# Altium schematic sheet DC-DC SY8029AIC.SchDoc
size A4
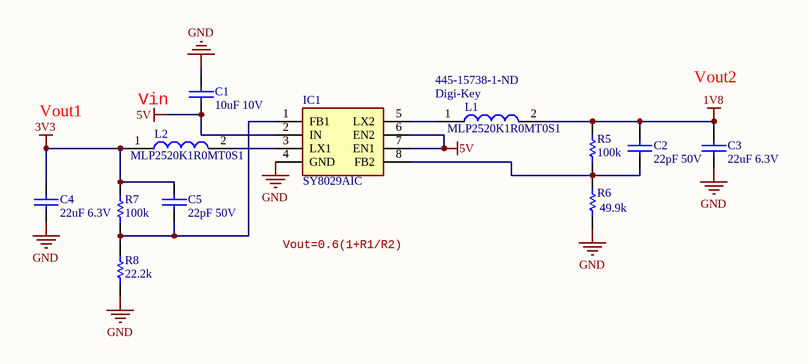
[diagram p0: DC-DC SY8029AIC.SchDoc]

## Parts
C1  10uF 10V  [0805C]
C2  22pF 50V  [0402C]
C3  22uF 6.3V  [0603C]
C4  22uF 6.3V  [0603C]
C5  22pF 50V  [0402C]
IC1  SY8029AIC  [SOT65P280X110-8N]
L1  MLP2520K1R0MT0S1  Supplier 1: Digi-Key  Supplier Part Number 1: 445-15738-1-ND  [INDC2520X100N]
L2  MLP2520K1R0MT0S1  [INDC2520X100N]
R5  100k  [0402R]
R6  49.9k  [0402R]
R7  100k  [0402R]
R8  22.2k  [0402R]

## Nets
1V8: C2.2 C3.2 L1.2 R5.2
3V3: C4.2 C5.2 L2.1 R7.2
5V: C1.1 IC1.2(IN) IC1.6(EN2) IC1.7(EN1)
GND: C1.2 C3.1 C4.1 IC1.4(GND) R6.1 R8.1
NetC2_1: C2.1 IC1.8(FB2) R5.1 R6.2
NetC5_1: C5.1 IC1.1(FB1) R7.1 R8.2
NetIC1_3: IC1.3(LX1) L2.2
NetIC1_5: IC1.5(LX2) L1.1

## Notes on the sheet
- Vout1
- Vin
- Vout2
- Vout=0.6(1+R1/R2)

## Library data of the parts
C1-C5 = CAP-NP
IC1 = SY8029AIC: Integrated Circuit; Manufacturer_Name: Silergy Corp; Datasheet Link: https://datasheet.lcsc.com/szlcsc/Silergy-Corp-SY8029AIC_C207636.pdf; Height: 1.1mm; Manufacturer_Part_Number: SY8029AIC
L1 L2 = MLP2520K1R0MT0S1: Inductor; Manufacturer_Name: TDK; Datasheet Link: https://www.arrow.com/en/products/mlp2520k1r0mt0s1/tdk; Height: 1mm; Manufacturer_Part_Number: MLP2520K1R0MT0S1; Arrow Part Number: MLP2520K1R0MT0S1; Arrow Price/Stock: https://www.arrow.com/en/products/mlp2520k1r0mt0s1/tdk; Mouser Part Number: 810-MLP2520K1R0MT0S1; Mouser Price/Stock: https://www.mouser.com/Search/Refine.aspx?Keyword=810-MLP2520K1R0MT0S1
R5-R8 = RES